# EAGLE design Arduino_V7 OLED (EAGLE 7.2.0)
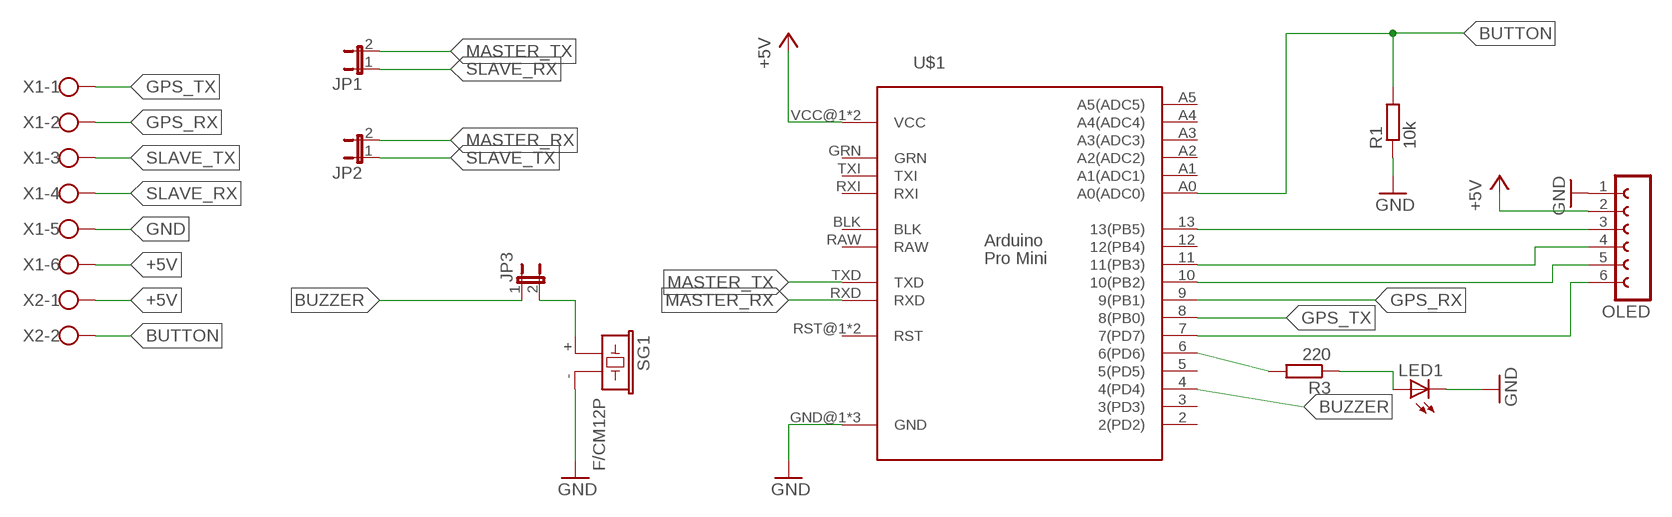
[diagram p0: schematic, sheet 1]

## Parts
JP1  JP1E  [JP1]
JP2  JP1E  [JP1]
JP3  JP1E  [JP1]
LED1  LED5MM  [LED5MM]
OLED  FE06-1  [FE06]
R1  10k  R-EU_0207/10  [0207/10]
R3  220  R-EU_0207/10  [0207/10]
SG1  F/CM12P  [F/CM12P]
U$1  PRO-MINI  [PRO-MINI]
X1  W237-6  [W237-6]
X2  W237-102  [W237-102]

## Nets
+5V: OLED.2 U$1.VCC@1(VCC) U$1.VCC@2(VCC) X1.6 X2.1
BUTTON: R1.2 U$1.A0(A0(ADC0)) X2.2
BUZZER: JP3.1 U$1.4(4(PD4))
CS: OLED.6 U$1.7(7(PD7))
DI: OLED.4 U$1.11(11(PB3))
GND: LED1.K(C) OLED.1 R1.1 SG1.- U$1.GND@1(GND) U$1.GND@2(GND) U$1.GND@3(GND) X1.5
GPS_RX: U$1.9(9(PB1)) X1.2
GPS_TX: U$1.8(8(PB0)) X1.1
MASTER_RX: JP2.2 U$1.RXD
MASTER_TX: JP1.2 U$1.TXD
N$2: OLED.3 U$1.13(13(PB5))
N$4: LED1.A R3.1
N$5: R3.2 U$1.6(6(PD6))
N$10: JP3.2 SG1.+
RST: OLED.5 U$1.10(10(PB2))
SLAVE_RX: JP1.1 X1.4
SLAVE_TX: JP2.1 X1.3
Unconnected: U$1.2(2(PD2)) U$1.3(3(PD3)) U$1.5(5(PD5)) U$1.12(12(PB4)) U$1.A1(A1(ADC1)) U$1.A2(A2(ADC2)) U$1.A3(A3(ADC3)) U$1.A4(A4(ADC4)) U$1.A5(A5(ADC5)) U$1.BLK U$1.GRN U$1.RAW U$1.RST@1(RST) U$1.RST@2(RST) U$1.RXI U$1.TXI

## Library data of the parts
JP1-JP3 = jumper:JP1E: JUMPER
LED1 = led:LED: LED OSRAM: - CHIPLED LG R971, LG N971, LY N971, LG Q971, LY Q971, LO R971, LY R971 LH N974, LH R974 LS Q976, LO Q976, LY Q976 LO Q996 - Hyper CHIPLED LW Q18S LB Q993, LB Q99A, LB R99A - SideLED LS A670, LO A670, LY A670, LG A670, LP A670 LB A673, LV A673, LT A673, LW A673 LH A674 LY A675 LS A676, LA A676, LO A676, LY A676, LW A676 LS A679, LY A679, LG A679 - Hyper Micro SIDELED® LS Y876, LA Y876, LO Y876, LY Y876 LT Y87S - SmartLED LW L88C, LW L88S LB L89C, LB L89S, LG L890 LS L89K, LO L89K, LY L89K LS L896, LA L896, LO L896, LY L896 - TOPLED LS T670, LO T670, LY T670, LG T670, LP T670 LSG T670, LSP T670, LSY T670, LOP T670, LYG T670 LG T671, LOG T671, LSG T671 LB T673, LV T673, LT T673, LW T673 LH T674 LS T676, LA T676, LO T676, LY T676, LB T676, LH T676, LSB T676, LW T676 LB T67C, LV T67C, LT T67C, LS T67K, LO T67K, LY T67K, LW E67C LS E67B, LA E67B, LO E67B, LY E67B, LB E67C, LV E67C, LT E67C LW T67C LS T679, LY T679, LG T679 LS T770, LO T770, LY T770, LG T770, LP T770 LB T773, LV T773, LT T773, LW T773 LH T774 LS E675, LA E675, LY E675, LS T675 LS T776, LA T776, LO T776, LY T776, LB T776 LHGB T686 LT T68C, LB T68C - Hyper Mini TOPLED® LB M676 - Mini TOPLED Santana® LG M470 LS M47K, LO M47K, LY M47K Source: http://www.osram.convergy.de LUXEON: - LUMILED® LXK2-PW12-R00, LXK2-PW12-S00, LXK2-PW14-U00, LXK2-PW14-V00 LXK2-PM12-R00, LXK2-PM12-S00, LXK2-PM14-U00 LXK2-PE12-Q00, LXK2-PE12-R00, LXK2-PE12-S00, LXK2-PE14-T00, LXK2-PE14-U00 LXK2-PB12-K00, LXK2-PB12-L00, LXK2-PB12-M00, LXK2-PB14-N00, LXK2-PB14-P00, LXK2-PB14-Q00 LXK2-PR12-L00, LXK2-PR12-M00, LXK2-PR14-Q00, LXK2-PR14-R00 LXK2-PD12-Q00, LXK2-PD12-R00, LXK2-PD12-S00 LXK2-PH12-R00, LXK2-PH12-S00 LXK2-PL12-P00, LXK2-PL12-Q00, LXK2-PL12-R00 Source: www.luxeon.com KINGBRIGHT: KA-3528ASYC Source: www.kingbright.com
OLED = con-lsta:FE06-1: FEMALE HEADER; OC_FARNELL: unknown; OC_NEWARK: unknown
R1 R3 = resistor:R-EU_: RESISTOR, European symbol
SG1 = buzzer:F/CM12P: BUZZER Source: Buerklin; OC_FARNELL: unknown; OC_NEWARK: unknown
U$1 = custom parts:PRO-MINI
X1 = con-wago-500:W237-6: WAGO SCREW CLAMP; OC_FARNELL: unknown; OC_NEWARK: unknown
X2 = con-wago-500:W237-102: WAGO SCREW CLAMP; MPN: 237-102; OC_FARNELL: unknown; OC_NEWARK: 70K9898

## Board
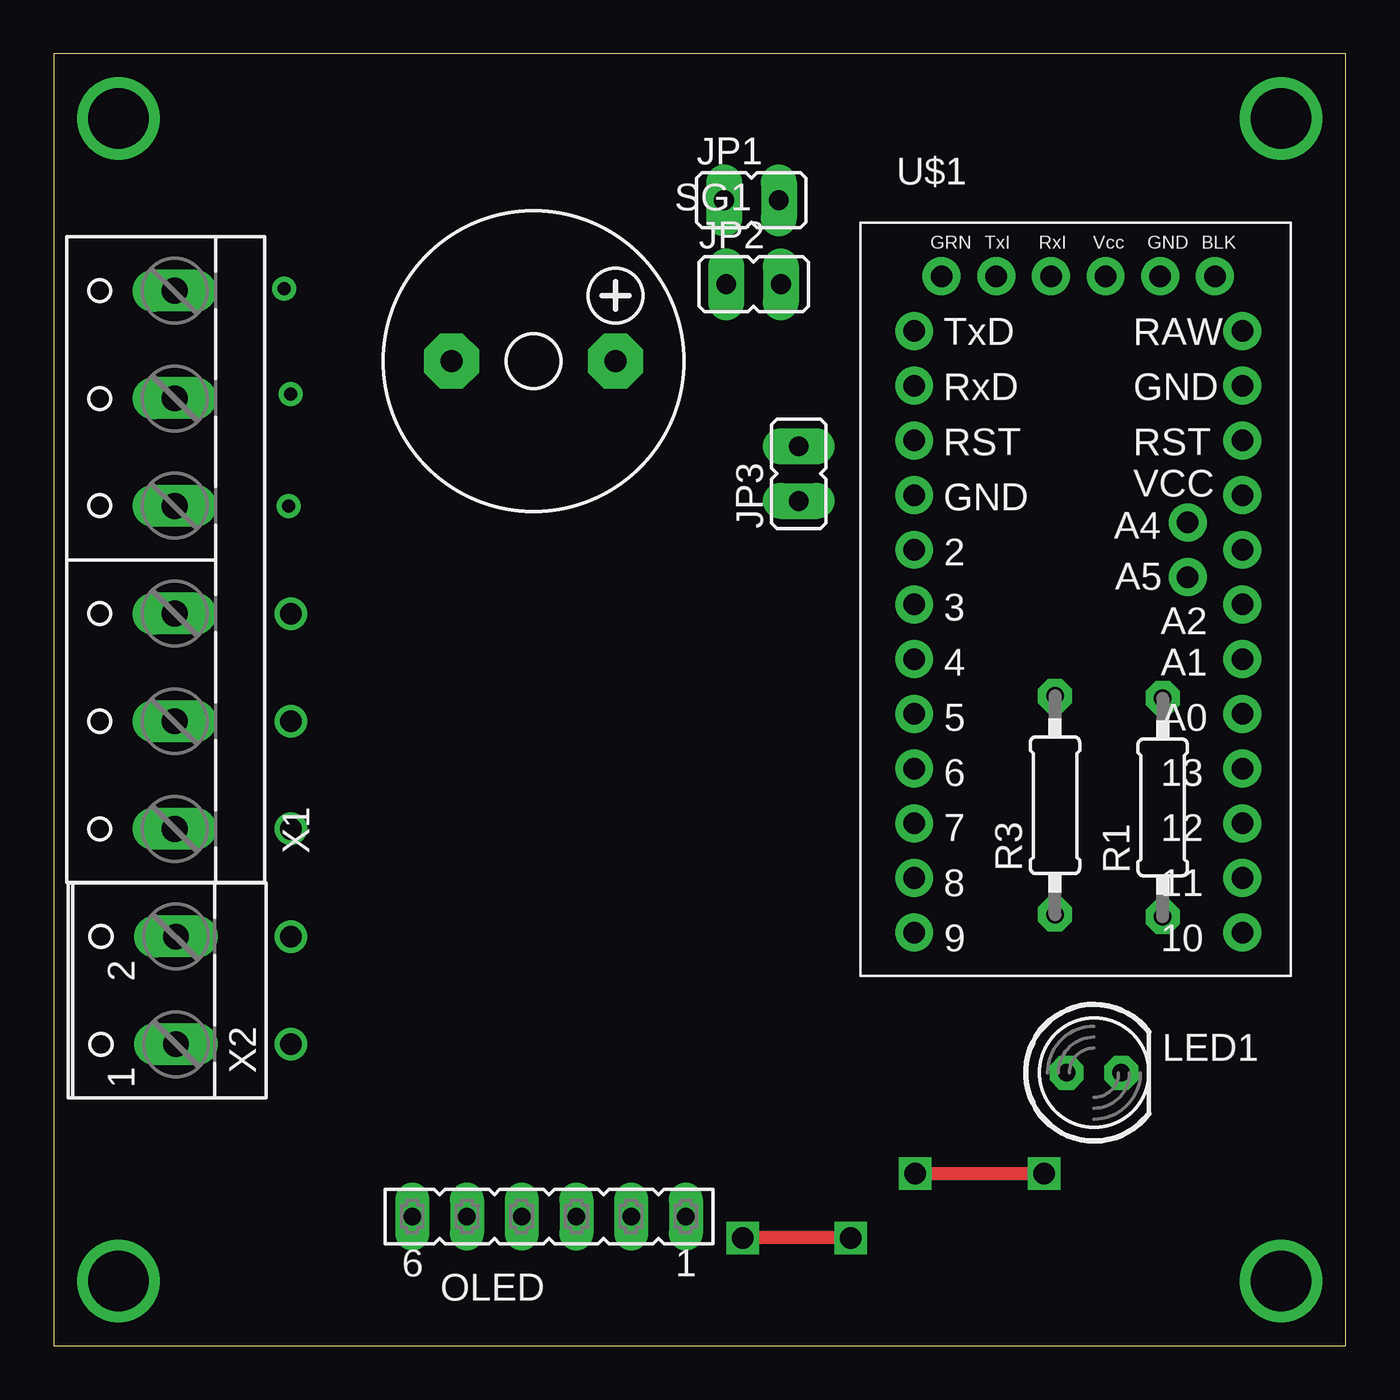
[diagram p1: board, top side]
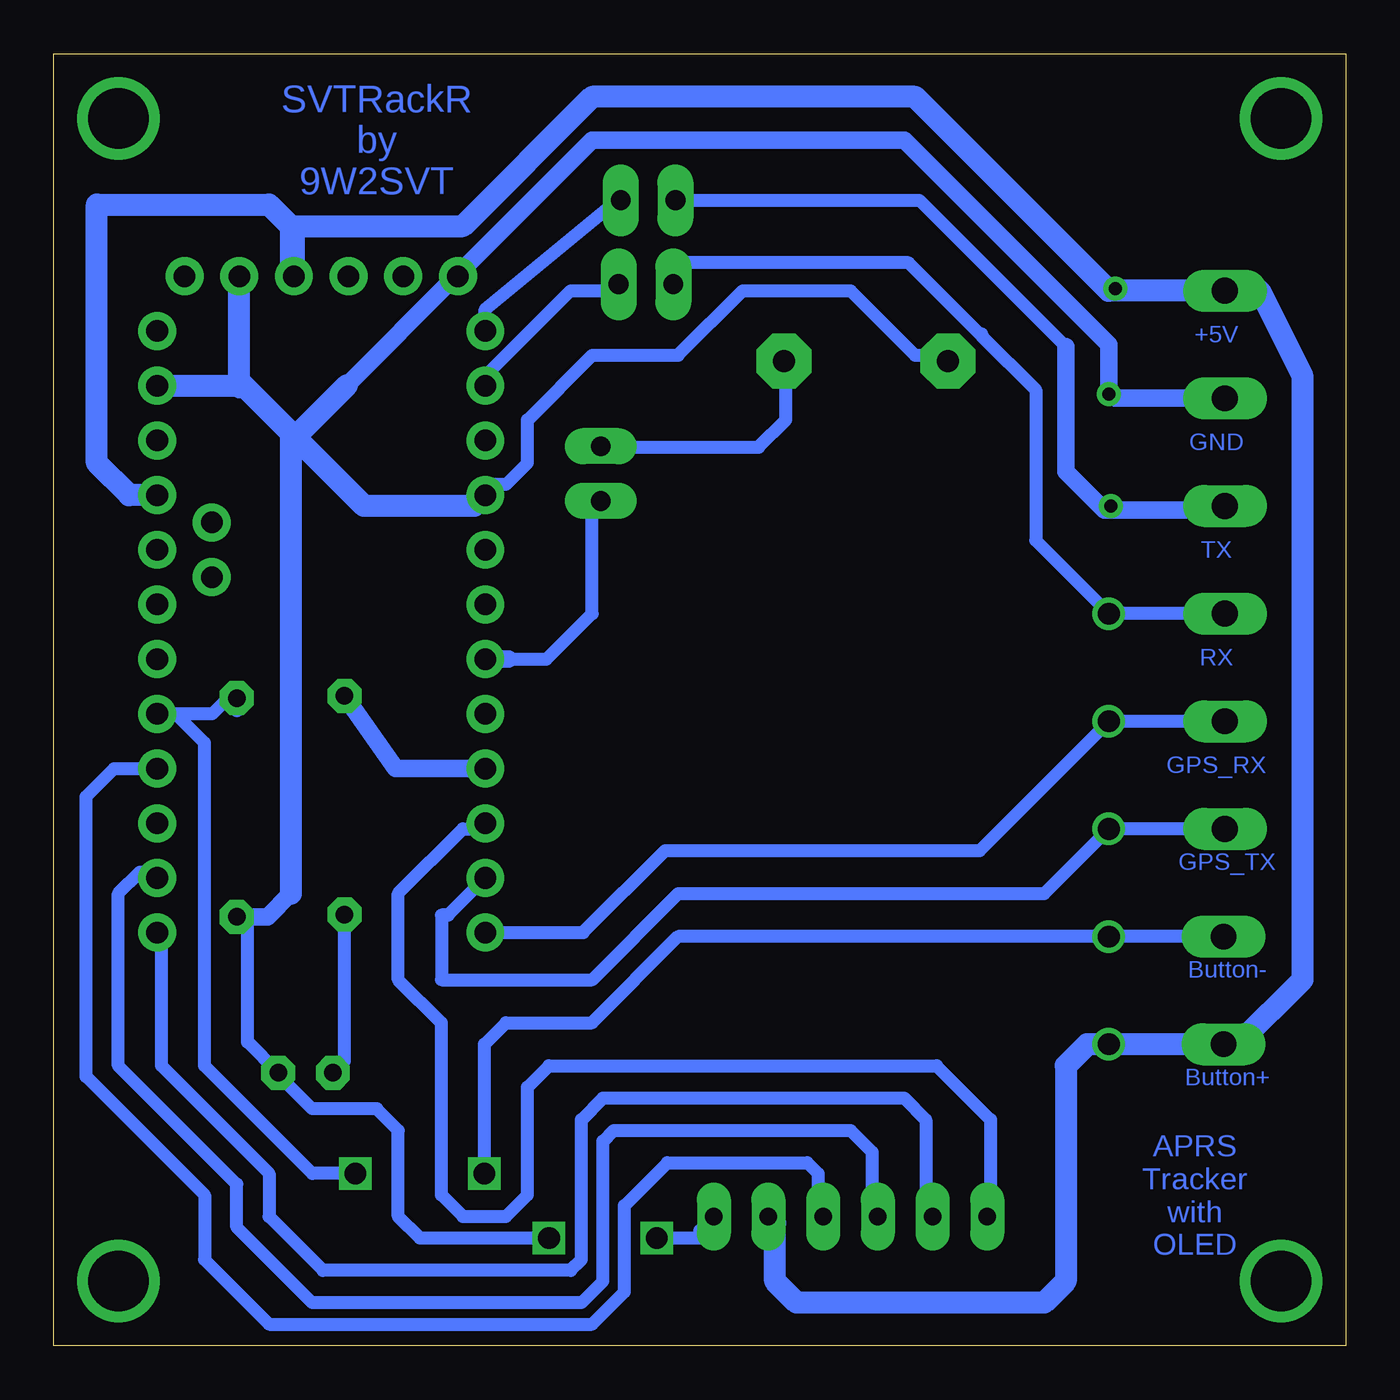
[diagram p2: board, bottom side, seen from below]

Size 60 x 60 mm. Coordinates in mm from the lower left corner, seen from the top.
Outline: 0,0 60,0 60,60 0,60 0,0
Copper layers (1*16): Top 0.035mm / dielectric 1.5mm / Bottom 0.035mm
Design rules "default": minimum track width 10mil, minimum drill 24mil, track to track 8mil, track to pad 8mil, pad to pad 8mil, via to via 8mil, smd to smd 8mil, copper to edge 40mil, drill to drill 8mil, minimum pad ring 15mil, minimum via ring 10mil, stop-mask expansion 4mil, vias tented up to drill 0mil, thermal gap 10mil

### Footprints (pad centres in the part's own frame; a part is rotated, then mirrored left to right if it is on the bottom)
JP1 = drill 0.914 long: 1 0,-1.27; 2 0,1.27
LED5MM = drill 0.813 octagon: A -1.27,0; K 1.27,0
FE06 = drill 0.813 long: 1 -6.35,0; 2 -3.81,0; 3 -1.27,0; 4 1.27,0; 5 3.81,0; 6 6.35,0
0207/10 = drill 0.813 octagon: 1 -5.08,0; 2 5.08,0
F/CM12P = drill 1.016 pad 2.54 octagon: + 3.81,0; - -3.81,0
PRO-MINI = drill 1: 2 2.48,19.794; 3 2.48,17.254; 4 2.48,14.714; 5 2.48,12.174; 6 2.48,9.634; 7 2.48,7.094; 8 2.48,4.554; 9 2.48,2.014; 10 17.72,2.014; 11 17.72,4.554; 12 17.72,7.094; 13 17.72,9.634; A0 17.72,12.174; A1 17.72,14.714; A2 17.72,17.254; A3 17.72,19.794; A4 15.18,21.064; A5 15.18,18.524; BLK 16.45,32.494; GND@1 2.48,22.334; GND@2 17.72,27.414; GND@3 13.91,32.494; GRN 3.75,32.494; RAW 17.72,29.954; RST@1 2.48,24.874; RST@2 17.72,24.874; RXD 2.48,27.414; RXI 8.83,32.494; TXD 2.48,29.954; TXI 6.29,32.494; VCC@1 17.72,22.334; VCC@2 11.37,32.494
W237-6 = drill 1.194 long: 1 -12.5,-1.27; 2 -7.5,-1.27; 3 -2.5,-1.27; 4 2.5,-1.27; 5 7.5,-1.27; 6 12.5,-1.27
W237-102 = drill 1.194 long: 1 -2.5,-1.27; 2 2.5,-1.27

### Placement (x,y rotation side)
JP1  32.4,53.2 270 top
JP2  32.5,49.3 270 top
JP3  34.6,40.5 0 top
LED1  48.31,12.68 0 top
OLED  23,6 180 top
R1  51.5,25 90 top
R3  46.5,25.1 90 top
SG1  22.28,45.73 0 top
U$1  37.48,17.17 0 top
X1  4.34,36.5 90 top
X2  4.4,16.5 90 top

### Tracks (layer width: path | path; a pad name or v marks a point on that pad's centre or on a via)
+5V
  Bottom 0.61: 48.9,49.71 U$1.VCC@2 | 5,14 X2.1
  Bottom 1.016: 5,14 2,17 2,45 4,49 X1.6 11,49 20,58 35,58 41,52 49,52 | U$1.VCC@1 56.5,39.5 58,41 58,53 50,53 49,52 | 49,52 49,49.81 U$1.VCC@2 48.85,51.85 49,52 | X2.1 12,14 13,13 13,3 14,2 25.5,2 26.5,3 26.5,5.69 OLED.2
BUTTON  (via drill 1)
  Top 0.61: v40,8 v46,8
  Bottom 0.61: X2.2 v11,19 31,19 35,15 39,15 40,14 v40,8 | R1.2 51.5,29.5 | R1.2 51.5,30.5 | R1.2 51.58,30 52,30 52.66,29.34 U$1.A0 54.34,29.34 53,28 53,13 48,8 v46,8
BUZZER
  Bottom 0.61: 38.88,31.88 37.12,31.88 35,34 35,39 34.83,39 JP3.1
  Bottom 0.813: U$1.4 38.88,31.88
CS
  Bottom 0.61: U$1.7 40.22,24 41,24 44,21 44,17 42,15 42,7 41,6 39,6 38,7 38,12 37,13 19,13 16.5,10.5 16.5,6.15 OLED.6 17,6.35
DI
  Bottom 0.61: OLED.4 22,6.27 22,9 23,10 34,10 34.5,9.5 34.5,3 35.5,2 48,2 51.5,5.5 51.5,7.5 57,13 57,21 56,22 55.48,22 U$1.11
GND  (via drill 1)
  Top 0.61: v37,5 v32,5
  Bottom 0.61: R1.1 51.08,19.92 51,20 51,14.1 LED1.K 49.58,12.58 48,11 45,11 44,10 44,6 43,5 v37,5 | v32,5 30,5 30,5.35 OLED.1 | SG1.- 18.74,46 20,46 23,49 28,49 31,46 35,46 38,43 38,41 39,40 39.46,40 U$1.GND@1
  Bottom 0.813: 55.18,44.6 U$1.GND@2 | 51.39,44.8 51.39,44.41 | X1.5 10.7,44 11,44.3 11,46.5 20.5,56 35,56 41.2,49.8 41.4,49.8 41.4,49.6 46.4,44.6 | 49,21 50.08,19.92 R1.1
  Bottom 1.016: 55.18,44.6 51.19,44.6 | U$1.GND@1 40.46,39 45.59,39 49,42.41 | 49,42 49,21 | 51.19,44.6 51.39,44.8 U$1.GND@3 | 51.19,44.6 49,42.41 | 49,42.41 49,42 | 46.4,44.6 49,42
GPS_RX  (via drill 1)
  Bottom 0.61: X1.2 v11,29 17,23 31.6,23 35.42,19.18 U$1.9
GPS_TX  (via drill 1)
  Bottom 0.61: 5.51,23.9 X1.1 v11,24 14,21 31,21 35,17 42,17 42,20 41.68,20 U$1.8
MASTER_RX
  Bottom 0.61: U$1.RXD 39.96,45.04 36,49 34,49 34,49.07 JP2.2
MASTER_TX
  Bottom 0.61: U$1.TXD 39.96,48.14 34.3,52.8 34.1,52.8 | 34.1,52.8 33.9,52.6 | 34.1,52.8 34.07,52.8 JP1.2
N$2
  Bottom 0.61: U$1.13 57.2,26.8 58.5,25.5 58.5,12.5 53,7 53,4 50,1 35,1 33.5,2.5 33.5,6.5 31.5,8.5 25,8.5 24.5,8 24.5,6.23 OLED.3
N$4
  Bottom 0.61: LED1.A 46.5,13.22 R3.1
N$5
  Bottom 0.813: U$1.6 44.12,26.8 R3.2
N$6  (via drill 2.8)
  other vias: 3,3
N$7  (via drill 2.8)
  other vias: 3,57
N$8  (via drill 2.8)
  other vias: 57,57
N$9  (via drill 2.8)
  other vias: 57,3
N$10
  Bottom 0.61: JP3.2 34.56,41.73 27.27,41.73 26,43 26,45.64 SG1.+
N$11  (via drill 0.6)
  other vias: 10.9,39
N$12  (via drill 0.6)
  other vias: 11,44.2
N$13  (via drill 0.6)
  other vias: 10.7,49.1
N$17  (via drill 1)
  other vias: 11,14
RST
  Bottom 0.61: U$1.10 55,18.98 55,13 50,8 50,6 47.5,3.5 36,3.5 35.5,4 35.5,10.5 34.5,11.5 20.5,11.5 19.5,10.5 19.5,6.31 OLED.5
SLAVE_RX
  Bottom 0.61: JP1.1 19.8,53.2 13,46.4 | 6.8,38.9 5.71,38.9 X1.4
  Bottom 0.813: 13,46.4 13,40.6 11.2,38.8 6.9,38.8 6.8,38.9
SLAVE_TX  (via drill 1)
  Bottom 0.61: X1.3 v11,34 14.4,37.4 14.4,44.4 16.9,46.9 | 16.9,47 16.9,46.9 | 16.9,46.9 20.3,50.3 30.7,50.3 31,50 31,49.53 JP2.1

### Text on the board
Bottom: SVTRackR / by / 9W2SVT | +5V | GND | TX | RX | GPS_RX | GPS_TX | Button- | Button+ | APRS / Tracker / with / OLED